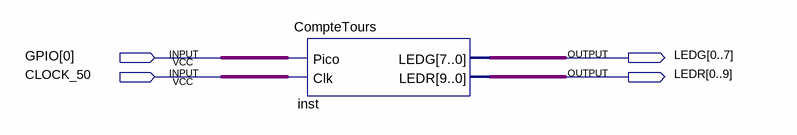
[diagram p0: schematic sheet]
// Quartus schematic CompteToursDE2_schema.bdf as structural Verilog: 1 symbols, 4 pins
module CompteToursDE2_schema (
  input  [0:0] GPIO,
  input  CLOCK_50,
  output [0:7] LEDG,
  output [0:9] LEDR
);

  CompteTours inst (.Pico(GPIO[0]), .Clk(CLOCK_50), .LEDG(LEDG), .LEDR(LEDR));
endmodule
